# EAGLE schematic RESC_V2 v61 (EAGLE 9.7.0)

## Sheet 1 of 7
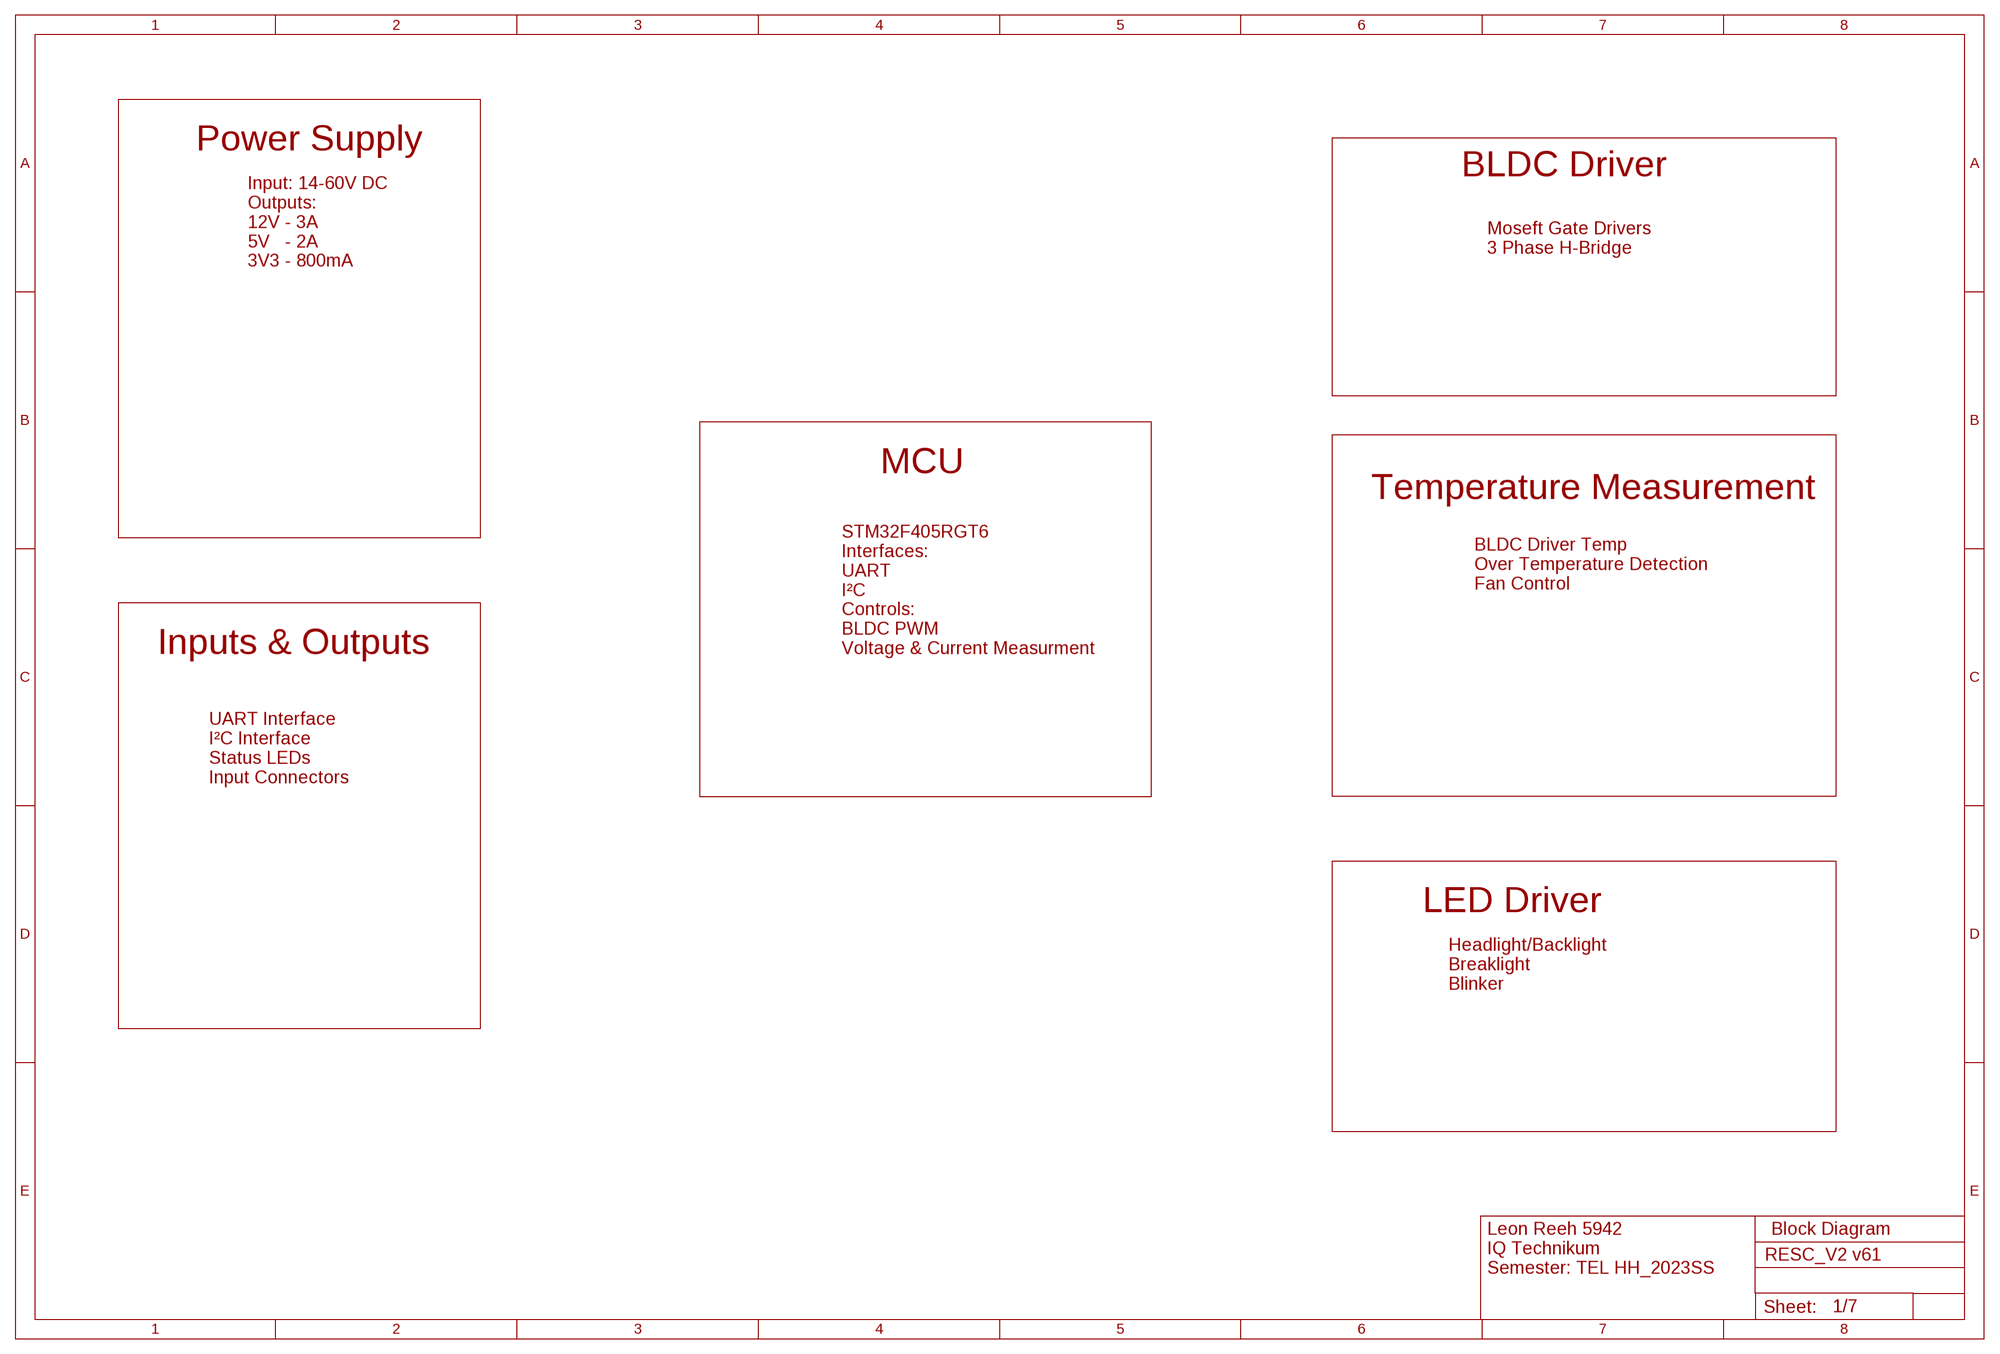
[diagram p0: schematic, sheet 1]

### Notes on the sheet
- Power Supply
- BLDC Driver
- Moseft Gate Drivers
  3 Phase H-Bridge
- Input: 14-60V DC
  Outputs:
  12V - 3A
  5V   - 2A
  3V3 - 800mA
- MCU
- Temperature Measurement
- BLDC Driver Temp
  Over Temperature Detection
  Fan Control
- Inputs & Outputs
- STM32F405RGT6
  Interfaces:
  UART
  I²C
  Controls:
  BLDC PWM
  Voltage & Current Measurment
- UART Interface
  I²C Interface
  Status LEDs
  Input Connectors
- LED Driver
- Headlight/Backlight
  Breaklight
  Blinker
- Block Diagram
- Leon Reeh 5942
  IQ Technikum
  Semester: TEL HH_2023SS

## Sheet 2 of 7
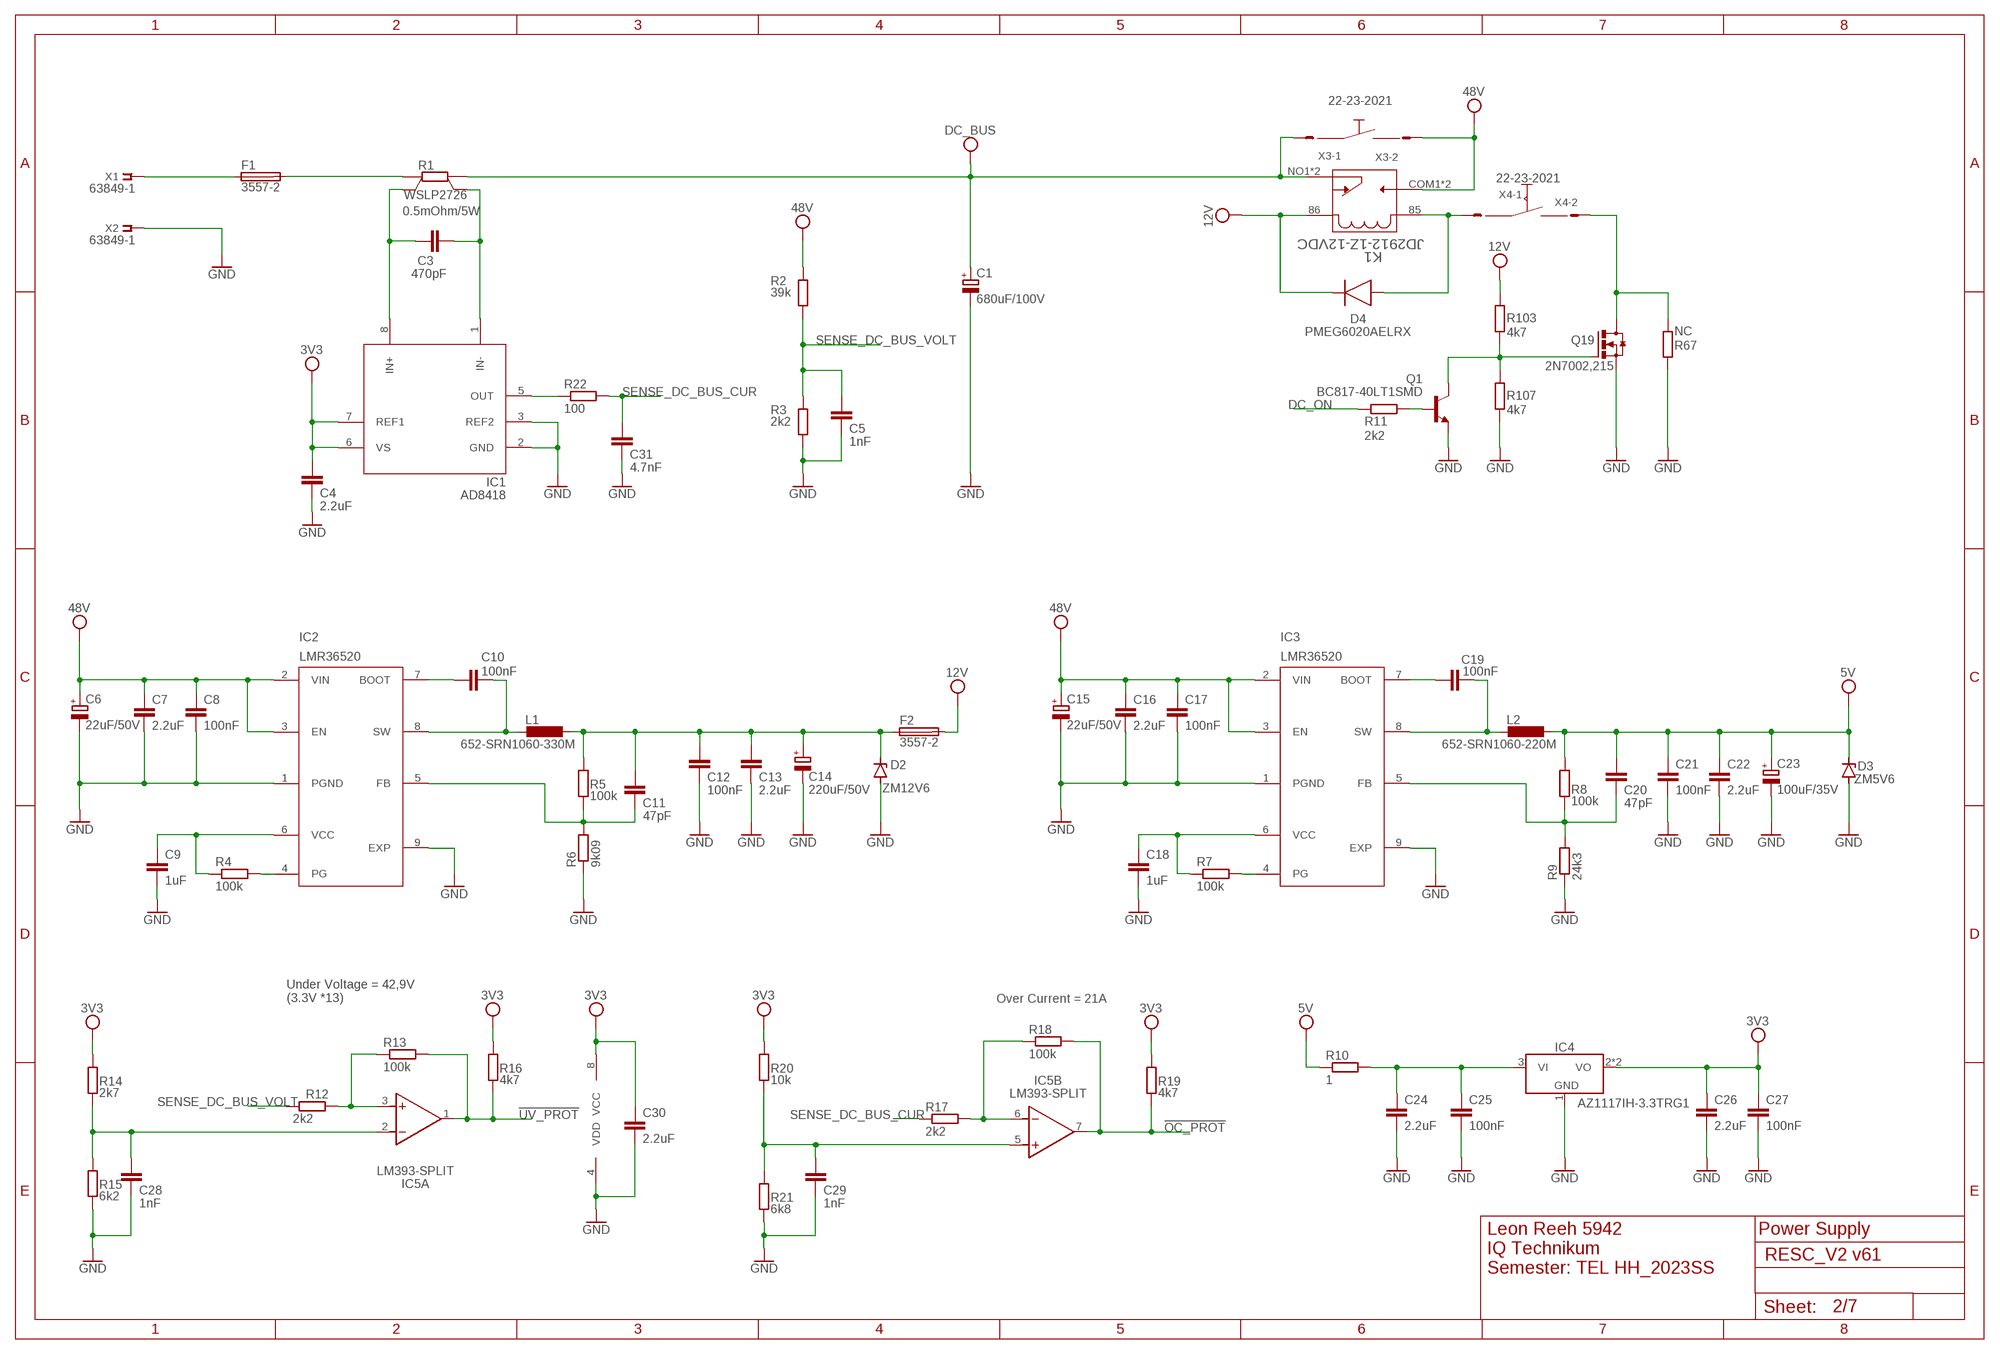
[diagram p1: schematic, sheet 2]

### Parts
C1  680uF/100V  CPOL-EUE10-35  [EB35D]
C3  470pF  C-EUC0603  [C0603]
C4  2.2uF  C-EUC0603  [C0603]
C5  1nF  C-EUC0603  [C0603]
C6  22uF/50V  CPOL-EUE2-5  [E2-5]
C7  2.2uF  C-EUC0805  [C0805]
C8  100nF  C-EUC0603  [C0603]
C9  1uF  C-EUC0805  [C0805]
C10  100nF  C-EUC0603  [C0603]
C11  47pF  C-EUC0603  [C0603]
C12  100nF  C-EUC0805  [C0805]
C13  2.2uF  C-EUC0805  [C0805]
C14  220uF/50V  CPOL-EU  [E5-13]
C15  22uF/50V  CPOL-EUE2-5  [E2-5]
C16  2.2uF  C-EUC0805  [C0805]
C17  100nF  C-EUC0603  [C0603]
C18  1uF  C-EUC0805  [C0805]
C19  100nF  C-EUC0603  [C0603]
C20  47pF  C-EUC0603  [C0603]
C21  100nF  C-EUC0805  [C0805]
C22  2.2uF  C-EUC0805  [C0805]
C23  100uF/35V  CPOL-EUE3.5-8  [E3,5-8]
C24  2.2uF  C-EUC0805  [C0805]
C25  100nF  C-EUC0805  [C0805]
C26  2.2uF  C-EUC0805  [C0805]
C27  100nF  C-EUC0805  [C0805]
C28  1nF  C-EUC0603  [C0603]
C29  1nF  C-EUC0603  [C0603]
C30  2.2uF  C-EUC0603  [C0603]
C31  4.7nF  C-EUC0603  [C0603]
D2  ZM12V6  ZENER_TZM5231BDO-213AA(SOD-80)  [DIOMELF3516]
D3  ZM5V6  ZENER_TZM5231BDO-213AA(SOD-80)  [DIOMELF3516]
D4  PMEG6020AELRX  DIODE_MMSD4148T1G_SOD123G  [SOD3715X135]
F1  3557-2  [M60]
F2  3557-2  [M60]
IC1  AD8418  [SOP65P490X110-8N]
IC2  LMR36520  [HSOIC]
IC3  LMR36520  [HSOIC]
IC4  AZ1117IH-3.3TRG1  [SOT230P700X170-4]
IC5  LM393-SPLIT  [SOIC127P600X175-8]
K1  JD2912-1Z-12VDC  [JD2912-1Z-12VDC]
L1  652-SRN1060-330M  7847870SRN1016  [SRN1016]
L2  652-SRN1060-220M  7847870SRN1016  [SRN1016]
Q1  BC817-40LT1SMD  [SOT23-BEC]
Q19  2N7002,215  [SOT23-3]
R1  WSLP2726  [WSLP2726]
R2  39k  R-EU_R0603  [R0603]
R3  2k2  R-EU_R0603  [R0603]
R4  100k  R-EU_R0603  [R0603]
R5  100k  R-EU_R0603  [R0603]
R6  9k09  R-EU_R0603  [R0603]
R7  100k  R-EU_R0603  [R0603]
R8  100k  R-EU_R0603  [R0603]
R9  24k3  R-EU_R0603  [R0603]
R10  1  R-EU_R1206  [R1206]
R11  2k2  R-EU_R0603  [R0603]
R12  2k2  R-EU_R0603  [R0603]
R13  100k  R-EU_R0603  [R0603]
R14  2k7  R-EU_R0603  [R0603]
R15  6k2  R-EU_R0603  [R0603]
R16  4k7  R-EU_R0603  [R0603]
R17  2k2  R-EU_R0603  [R0603]
R18  100k  R-EU_R0603  [R0603]
R19  4k7  R-EU_R0603  [R0603]
R20  10k  R-EU_R0603  [R0603]
R21  6k8  R-EU_R0603  [R0603]
R22  100  R-EU_R0603  [R0603]
R67  NC  R-EU_R1206  [R1206]
R103  4k7  R-EU_R0603  [R0603]
R107  4k7  R-EU_R0603  [R0603]
X1  63849-1  [63849-1]
X2  63849-1  [63849-1]
X3  22-23-2021  [22-23-2021]
X4  22-23-2021  [22-23-2021]

### Nets
3V3: C4.1 C26.1 C27.1 C30.1 IC1.6(VS) IC1.7(REF1) IC4.2(VO) IC4.4(VO) IC5.8(SUPPLY:VCC) R14.2 R16.2 R19.2 R20.2 ; also sheet 3,4,5,6,7
5V: C20.1 C21.1 C22.1 C23.+ D3.1(C) L2.1 R8.2 R10.1 ; also sheet 3,7
12V: D4.1(C) F2.P$3 F2.P$4 K1.86(A2) R103.2 ; also sheet 4,5,6,7
48V: C6.+ C7.1 C8.1 C15.+ C16.1 C17.1 IC2.2(VIN) IC2.3(EN) IC3.2(VIN) IC3.3(EN) K1.COM1 K1.COM2 R2.1 X3.2
!OC_PROT: IC5.7(B:OUT) R18.2 R19.1 ; also sheet 3
!UV_PROT: IC5.1(A:OUT) R13.2 R16.1 ; also sheet 3
DC_BUS: C1.+ K1.NO1 K1.NO2 R1.P$1(A) X3.1 ; also sheet 4
DC_ON: R11.1 ; also sheet 3
GND: C1.- C4.2 C5.2 C6.- C7.2 C8.2 C9.2 C12.2 C13.2 C14.- C15.- C16.2 C17.2 C18.2 C21.2 C22.2 C23.- C24.2 C25.2 C26.2 C27.2 C28.2 C29.2 C30.2 C31.2 D2.2(A) D3.2(A) IC1.2(GND) IC1.3(REF2) IC2.1(PGND) IC2.9(EXP) IC3.1(PGND) IC3.9(EXP) IC4.1(GND) IC5.4(SUPPLY:VDD) Q1.E Q19.2(S) R3.2 R6.1 R9.1 R15.1 R21.1 R67.2 R107.1 X2.1(S) X2.2(S) ; also sheet 3,4,5,6,7
N$1: F1.P$1 F1.P$2 X1.1(S) X1.2(S)
N$2: F1.P$3 F1.P$4 R1.P$2(B)
N$3: C3.1 IC1.8(IN+) R1.P$4(SB)
N$4: C3.2 IC1.1(IN-) R1.P$3(SA)
N$5: C18.1 IC3.6(VCC) R7.1
N$6: C10.2 IC2.8(SW) L1.2
N$7: Q19.3(D) R67.1 X4.2
N$8: C9.1 IC2.6(VCC) R4.1
N$9: IC2.4(PG) R4.2
N$10: C10.1 IC2.7(BOOT)
N$11: C11.2 IC2.5(FB) R5.1 R6.2
N$12: C11.1 C12.1 C13.1 C14.+ D2.1(C) F2.P$1 F2.P$2 L1.1 R5.2
N$13: IC3.4(PG) R7.2
N$14: C19.2 IC3.8(SW) L2.2
N$15: C19.1 IC3.7(BOOT)
N$16: C20.2 IC3.5(FB) R8.1 R9.2
N$17: C24.1 C25.1 IC4.3(VI) R10.2
N$18: D4.2(A) K1.85(A1) X4.1
N$19: Q1.C Q19.1(G) R103.1 R107.2
N$20: Q1.B R11.2
N$22: IC5.3(A:+IN) R12.2 R13.1
N$23: IC5.6(B:-IN) R17.2 R18.1
N$24: C28.1 IC5.2(A:-IN) R14.1 R15.2
N$25: IC1.5(OUT) R22.1
N$26: C29.1 IC5.5(B:+IN) R20.1 R21.2
SENSE_DC_BUS_CUR: C31.1 R17.1 R22.2 ; also sheet 3
SENSE_DC_BUS_VOLT: C5.1 R2.2 R3.1 R12.1 ; also sheet 3

### Notes on the sheet
- 0.5mOhm/5W
- Over Current = 21A
- Under Voltage = 42,9V
  (3.3V *13)
- Power Supply
- Leon Reeh 5942
  IQ Technikum
  Semester: TEL HH_2023SS

## Sheet 3 of 7
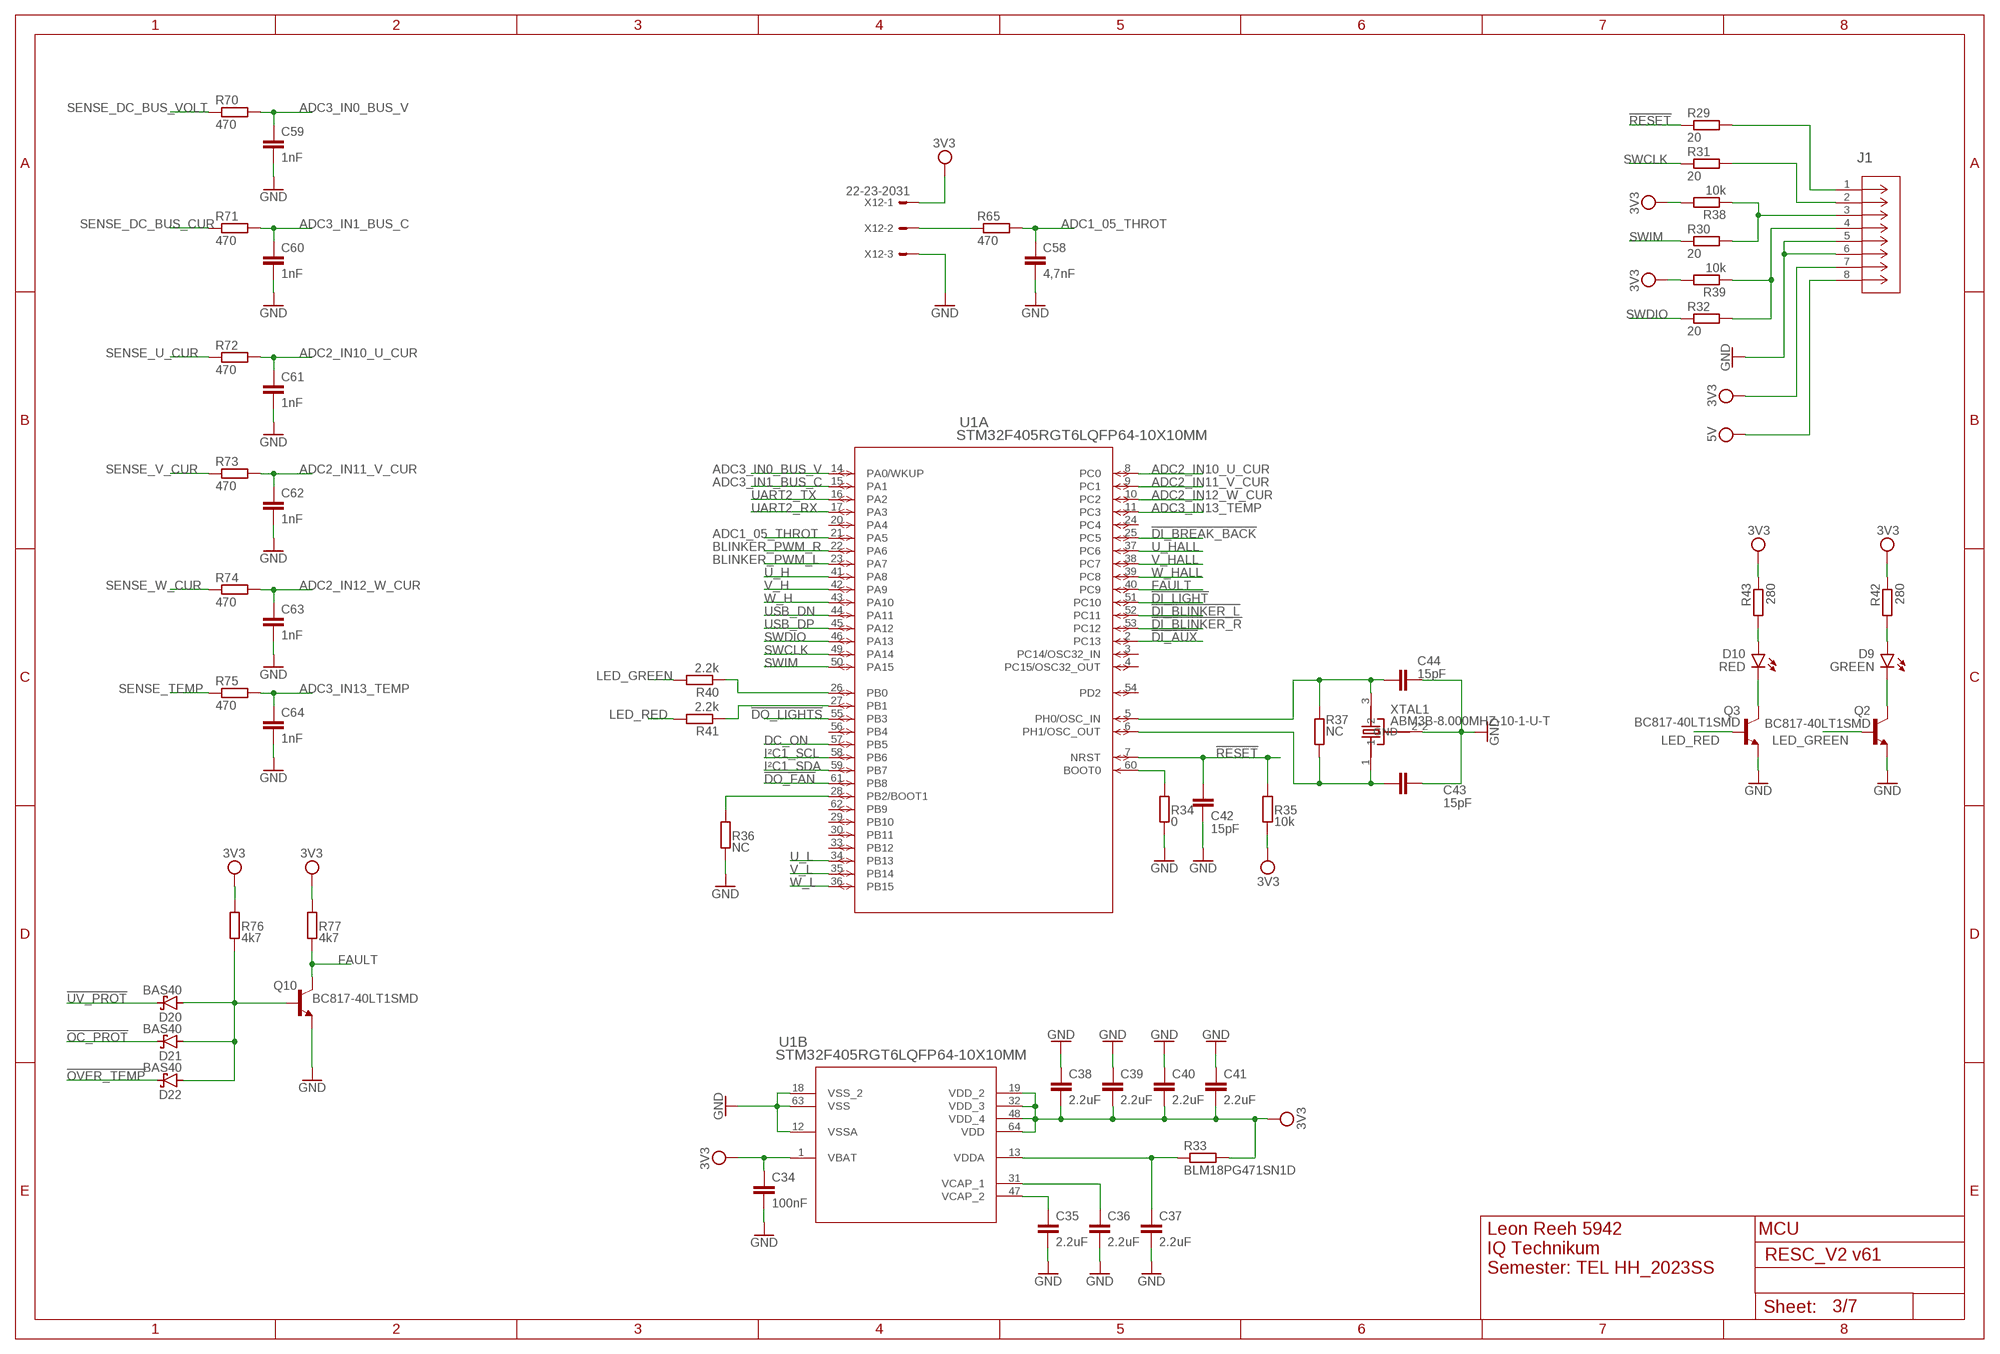
[diagram p2: schematic, sheet 3]

### Parts
C34  100nF  C-EUC0603  [C0603]
C35  2.2uF  C-EUC0805  [C0805]
C36  2.2uF  C-EUC0805  [C0805]
C37  2.2uF  C-EUC0805  [C0805]
C38  2.2uF  C-EUC0805  [C0805]
C39  2.2uF  C-EUC0805  [C0805]
C40  2.2uF  C-EUC0805  [C0805]
C41  2.2uF  C-EUC0805  [C0805]
C42  15pF  C-EUC0603  [C0603]
C43  15pF  C-EUC0603  [C0603]
C44  15pF  C-EUC0603  [C0603]
C58  4,7nF  C-EUC0603  [C0603]
C59  1nF  C-EUC0603  [C0603]
C60  1nF  C-EUC0603  [C0603]
C61  1nF  C-EUC0603  [C0603]
C62  1nF  C-EUC0603  [C0603]
C63  1nF  C-EUC0603  [C0603]
C64  1nF  C-EUC0603  [C0603]
D9  GREEN  CHIP-FLAT-B_1206  [LEDC3216X75N_FLAT-B]
D10  RED  CHIP-FLAT-B_1206  [LEDC3216X75N_FLAT-B]
D20  BAS40  [SOT23]
D21  BAS40  [SOT23]
D22  BAS40  [SOT23]
J1  BM08B-SRSS-TB(LF)(SN)CONN_BM08B-SRSS-TB(LF)(SN)_JST  [CONN_BM08B-SRSS-TB(LF)(SN)_JST]
Q2  BC817-40LT1SMD  [SOT23-BEC]
Q3  BC817-40LT1SMD  [SOT23-BEC]
Q10  BC817-40LT1SMD  [SOT23-BEC]
R29  20  R-EU_R0603  [R0603]
R30  20  R-EU_R0603  [R0603]
R31  20  R-EU_R0603  [R0603]
R32  20  R-EU_R0603  [R0603]
R33  BLM18PG471SN1D  R-EU_R0603  [R0603]
R34  0  R-EU_R0603  [R0603]
R35  10k  R-EU_R0603  [R0603]
R36  NC  R-EU_R0603  [R0603]
R37  NC  R-EU_R0603  [R0603]
R38  10k  R-EU_R0603  [R0603]
R39  10k  R-EU_R0603  [R0603]
R40  2.2k  R-EU_R0603  [R0603]
R41  2.2k  R-EU_R0603  [R0603]
R42  280  R-EU_R1206  [R1206]
R43  280  R-EU_R1206  [R1206]
R65  470  R-EU_R0603  [R0603]
R70  470  R-EU_R0603  [R0603]
R71  470  R-EU_R0603  [R0603]
R72  470  R-EU_R0603  [R0603]
R73  470  R-EU_R0603  [R0603]
R74  470  R-EU_R0603  [R0603]
R75  470  R-EU_R0603  [R0603]
R76  4k7  R-EU_R0603  [R0603]
R77  4k7  R-EU_R0603  [R0603]
U1  STM32F405RGT6LQFP64-10X10MM  [LQFP64-10X10MM]
X12  22-23-2031  [22-23-2031]
XTAL1  ABM3B-8.000MHZ-10-1-U-T  7BFREQUENCY_8MHZ  [OSCSC500X320X105-4N]

### Nets
3V3: C34.1 C38.2 C39.2 C40.2 C41.2 J1.7 R33.2 R35.1 R38.2 R39.2 R42.1 R43.1 R76.2 R77.2 U1.1(B:VBAT) U1.19(B:VDD_2) U1.32(B:VDD_3) U1.48(B:VDD_4) U1.64(B:VDD) X12.1 ; also sheet 2,4,5,6,7
5V: J1.8 ; also sheet 2,7
!DI_AUX: U1.2(A:PC13) ; also sheet 7
!DI_BLINKER_L: U1.52(A:PC11) ; also sheet 7
!DI_BLINKER_R: U1.53(A:PC12) ; also sheet 7
!DI_BREAK_BACK: U1.25(A:PC5) ; also sheet 5,7
!DI_LIGHT: U1.51(A:PC10) ; also sheet 7
!DO_FAN: U1.61(A:PB8) ; also sheet 6
!DO_LIGHTS: U1.55(A:PB3) ; also sheet 5
!OC_PROT: D21.3(C) ; also sheet 2
!OVER_TEMP: D22.3(C) ; also sheet 6
!RESET: C42.1 R29.1 R35.2 U1.7(A:NRST)
!UV_PROT: D20.3(C) ; also sheet 2
ADC1_05_THROT: C58.1 R65.2 U1.21(A:PA5)
ADC2_IN10_U_CUR: C61.1 R72.2 U1.8(A:PC0)
ADC2_IN11_V_CUR: C62.1 R73.2 U1.9(A:PC1)
ADC2_IN12_W_CUR: C63.1 R74.2 U1.10(A:PC2)
ADC3_IN0_BUS_V: C59.1 R70.2 U1.14(A:PA0/WKUP)
ADC3_IN1_BUS_C: C60.1 R71.2 U1.15(A:PA1)
ADC3_IN13_TEMP: C64.1 R75.2 U1.11(A:PC3)
BLINKER_PWM_L: U1.23(A:PA7) ; also sheet 5
BLINKER_PWM_R: U1.22(A:PA6) ; also sheet 5
DC_ON: U1.57(A:PB5) ; also sheet 2
FAULT: Q10.C R77.1 U1.40(A:PC9)
GND: C34.2 C35.2 C36.2 C37.2 C38.1 C39.1 C40.1 C41.1 C42.2 C43.2 C44.2 C58.2 C59.2 C60.2 C61.2 C62.2 C63.2 C64.2 J1.5 J1.6 Q2.E Q3.E Q10.E R34.1 R36.1 U1.12(B:VSSA) U1.18(B:VSS_2) U1.63(B:VSS) X12.3 XTAL1.2(GND) XTAL1.4(GND) ; also sheet 2,4,5,6,7
I²C1_SCL: U1.58(A:PB6) ; also sheet 7
I²C1_SDA: U1.59(A:PB7) ; also sheet 7
LED_GREEN: Q2.B R40.2
LED_RED: Q3.B R41.2
N$29: J1.1 R29.2
N$30: J1.2 R31.2
N$36: C35.1 U1.47(B:VCAP_2)
N$37: C36.1 U1.31(B:VCAP_1)
N$38: C37.1 R33.1 U1.13(B:VDDA)
N$39: R34.2 U1.60(A:BOOT0)
N$40: R36.2 U1.28(A:PB2/BOOT1)
N$41: C43.1 R37.1 U1.6(A:PH1/OSC_OUT) XTAL1.1
N$42: C44.1 R37.2 U1.5(A:PH0/OSC_IN) XTAL1.3
N$43: R41.1 U1.27(A:PB1)
N$44: R40.1 U1.26(A:PB0)
N$45: D9.A R42.2
N$46: D9.C Q2.C
N$47: D10.C Q3.C
N$48: D10.A R43.2
N$63: R65.1 X12.2
N$72: D20.1(A) D21.1(A) D22.1(A) Q10.B R76.1
SENSE_DC_BUS_CUR: R71.1 ; also sheet 2
SENSE_DC_BUS_VOLT: R70.1 ; also sheet 2
SENSE_TEMP: R75.1 ; also sheet 6
SENSE_U_CUR: R72.1 ; also sheet 4
SENSE_V_CUR: R73.1 ; also sheet 4
SENSE_W_CUR: R74.1 ; also sheet 4
SWCLK: R31.1 U1.49(A:PA14)
SWCLK1: J1.4 R32.2 R39.1
SWDIO: R32.1 U1.46(A:PA13)
SWDIO1: J1.3 R30.2 R38.1
SWIM: R30.1 U1.50(A:PA15)
U_H: U1.41(A:PA8) ; also sheet 4
U_HALL: U1.37(A:PC6) ; also sheet 7
U_L: U1.34(A:PB13) ; also sheet 4
UART2_RX: U1.17(A:PA3) ; also sheet 7
UART2_TX: U1.16(A:PA2) ; also sheet 7
USB_DN: U1.44(A:PA11)
USB_DP: U1.45(A:PA12)
V_H: U1.42(A:PA9) ; also sheet 4
V_HALL: U1.38(A:PC7) ; also sheet 7
V_L: U1.35(A:PB14) ; also sheet 4
W_H: U1.43(A:PA10) ; also sheet 4
W_HALL: U1.39(A:PC8) ; also sheet 7
W_L: U1.36(A:PB15) ; also sheet 4
Unconnected: U1.3(A:PC14/OSC32_IN) U1.4(A:PC15/OSC32_OUT) U1.20(A:PA4) U1.24(A:PC4) U1.29(A:PB10) U1.30(A:PB11) U1.33(A:PB12) U1.54(A:PD2) U1.56(A:PB4) U1.62(A:PB9)

### Notes on the sheet
- MCU
- Leon Reeh 5942
  IQ Technikum
  Semester: TEL HH_2023SS

## Sheet 4 of 7
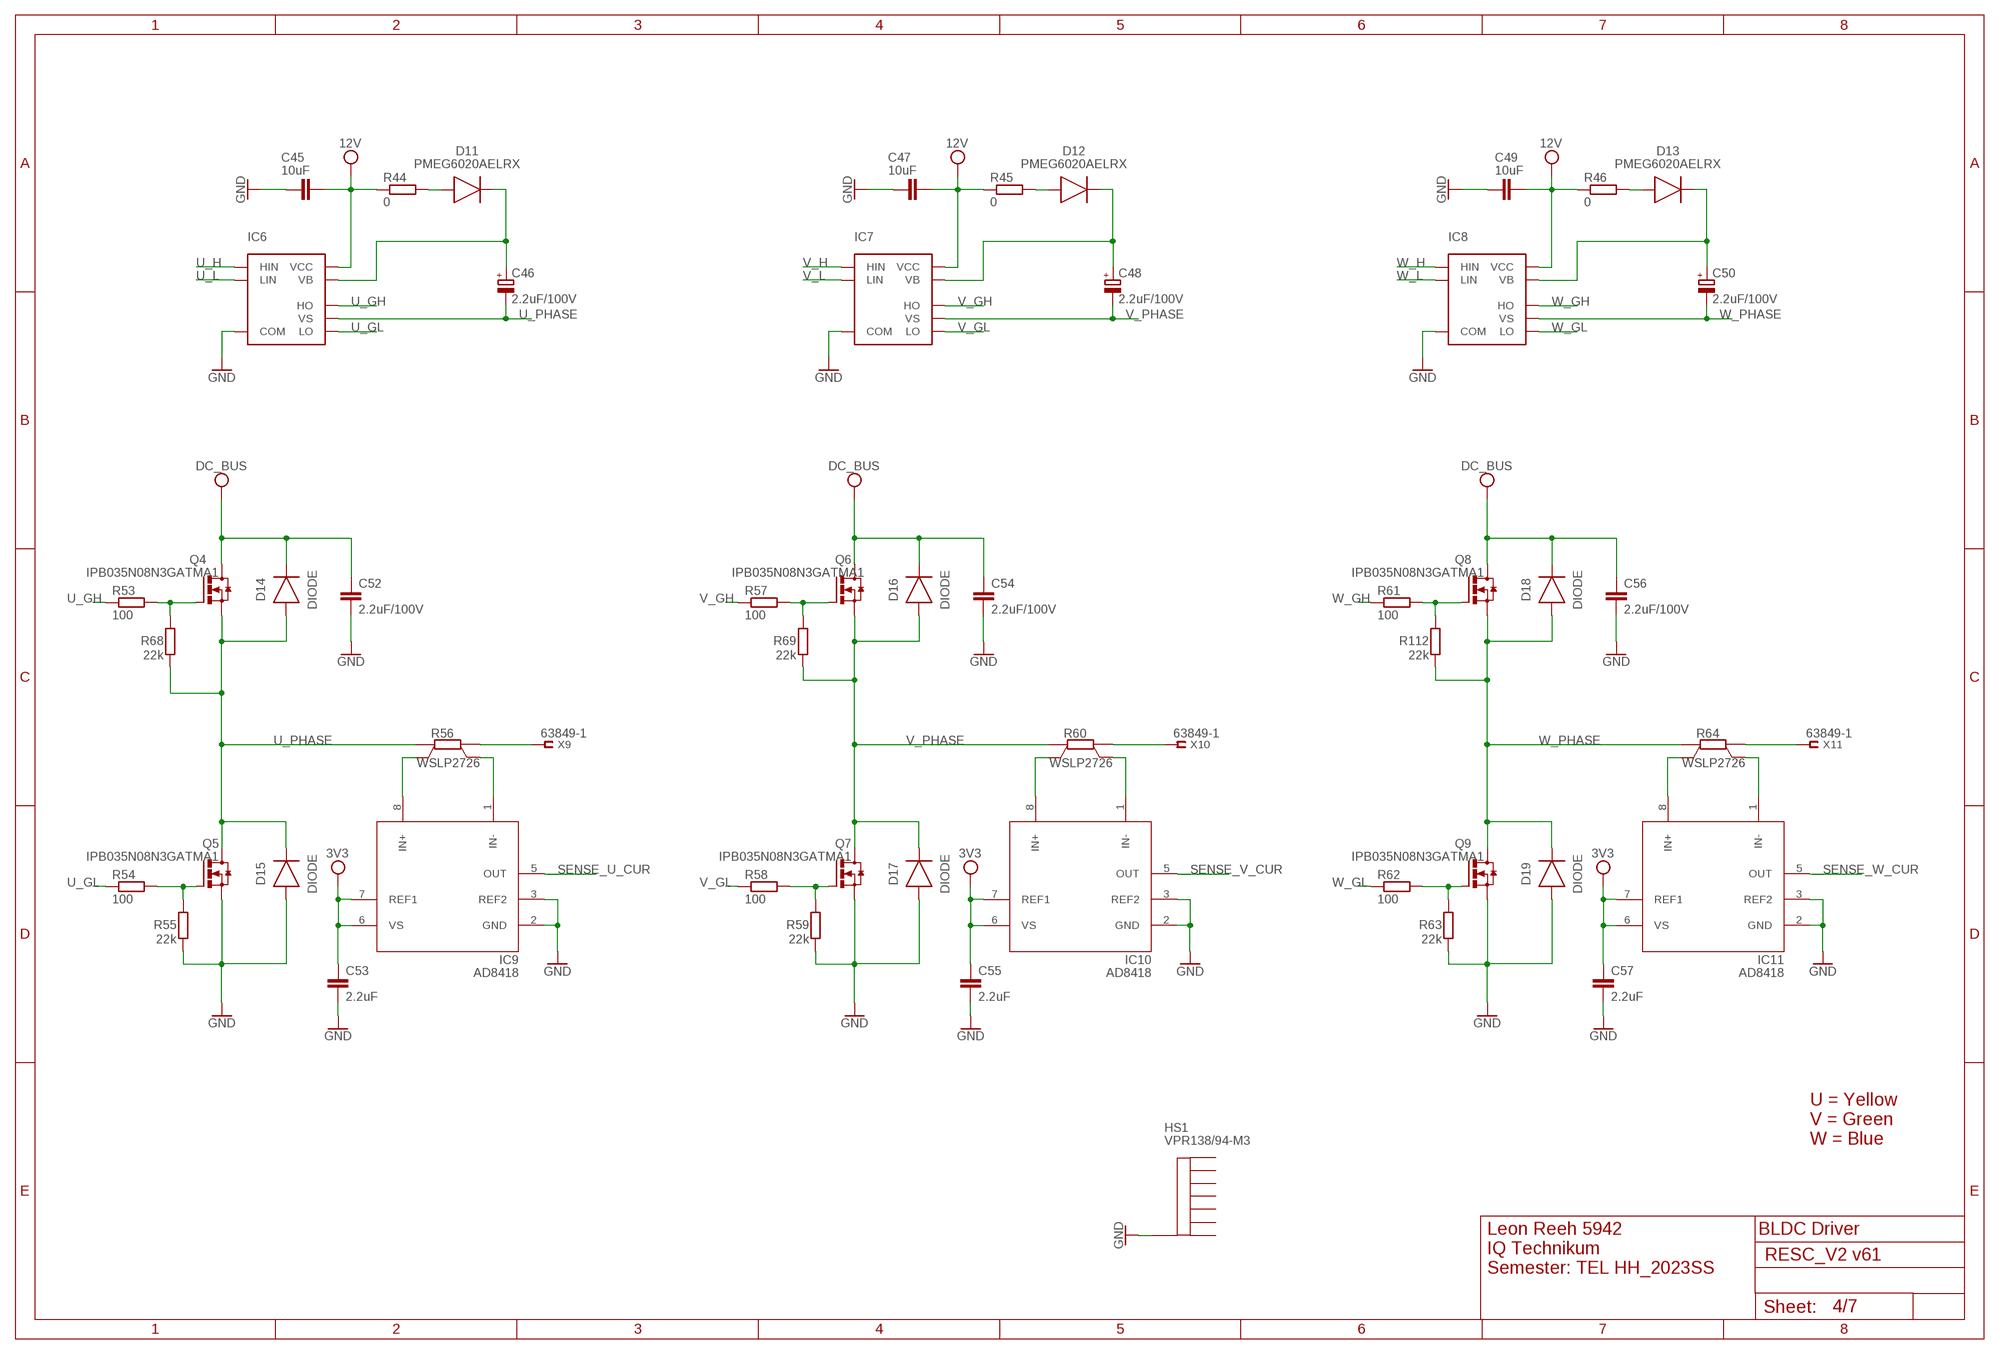
[diagram p3: schematic, sheet 4]

### Parts
C45  10uF  C-EUC1206  [C1206]
C46  2.2uF/100V  CPOL-EUE2-5  [E2-5]
C47  10uF  C-EUC1206  [C1206]
C48  2.2uF/100V  CPOL-EUE2-5  [E2-5]
C49  10uF  C-EUC1206  [C1206]
C50  2.2uF/100V  CPOL-EUE2-5  [E2-5]
C52  2.2uF/100V  C-EUC1210  [C1210]
C53  2.2uF  C-EUC0603  [C0603]
C54  2.2uF/100V  C-EUC1210  [C1210]
C55  2.2uF  C-EUC0603  [C0603]
C56  2.2uF/100V  C-EUC1210  [C1210]
C57  2.2uF  C-EUC0603  [C0603]
D11  PMEG6020AELRX  DIODE_MMSD4148T1G_SOD123G  [SOD3715X135]
D12  PMEG6020AELRX  DIODE_MMSD4148T1G_SOD123G  [SOD3715X135]
D13  PMEG6020AELRX  DIODE_MMSD4148T1G_SOD123G  [SOD3715X135]
D14  DIODE  DIODEDO-214AA(SMB)  [DIOM5336X265N]
D15  DIODE  DIODEDO-214AA(SMB)  [DIOM5336X265N]
D16  DIODE  DIODEDO-214AA(SMB)  [DIOM5336X265N]
D17  DIODE  DIODEDO-214AA(SMB)  [DIOM5336X265N]
D18  DIODE  DIODEDO-214AA(SMB)  [DIOM5336X265N]
D19  DIODE  DIODEDO-214AA(SMB)  [DIOM5336X265N]
HS1  VPR138/94-M3  [VPR138/94-M3]
IC6  IR2101S  [SO08]
IC7  IR2101S  [SO08]
IC8  IR2101S  [SO08]
IC9  AD8418  [SOP65P490X110-8N]
IC10  AD8418  [SOP65P490X110-8N]
IC11  AD8418  [SOP65P490X110-8N]
Q4  IPB035N08N3GATMA1  [PG-TO263-3]
Q5  IPB035N08N3GATMA1  [PG-TO263-3]
Q6  IPB035N08N3GATMA1  [PG-TO263-3]
Q7  IPB035N08N3GATMA1  [PG-TO263-3]
Q8  IPB035N08N3GATMA1  [PG-TO263-3]
Q9  IPB035N08N3GATMA1  [PG-TO263-3]
R44  0  R-EU_R1206  [R1206]
R45  0  R-EU_R1206  [R1206]
R46  0  R-EU_R1206  [R1206]
R53  100  R-EU_R1206  [R1206]
R54  100  R-EU_R1206  [R1206]
R55  22k  R-EU_R1206  [R1206]
R56  WSLP2726  [WSLP2726]
R57  100  R-EU_R1206  [R1206]
R58  100  R-EU_R1206  [R1206]
R59  22k  R-EU_R1206  [R1206]
R60  WSLP2726  [WSLP2726]
R61  100  R-EU_R1206  [R1206]
R62  100  R-EU_R1206  [R1206]
R63  22k  R-EU_R1206  [R1206]
R64  WSLP2726  [WSLP2726]
R68  22k  R-EU_R1206  [R1206]
R69  22k  R-EU_R1206  [R1206]
R112  22k  R-EU_R1206  [R1206]
X9  63849-1  [63849-1]
X10  63849-1  [63849-1]
X11  63849-1  [63849-1]

### Nets
3V3: C53.1 C55.1 C57.1 IC9.6(VS) IC9.7(REF1) IC10.6(VS) IC10.7(REF1) IC11.6(VS) IC11.7(REF1) ; also sheet 2,3,5,6,7
12V: C45.2 C47.2 C49.2 IC6.1(VCC) IC7.1(VCC) IC8.1(VCC) R44.1 R45.1 R46.1 ; also sheet 2,5,6,7
DC_BUS: C52.1 C54.1 C56.1 D14.1(C) D16.1(C) D18.1(C) Q4.2(D) Q6.2(D) Q8.2(D) ; also sheet 2
GND: C45.1 C47.1 C49.1 C52.2 C53.2 C54.2 C55.2 C56.2 C57.2 D15.2(A) D17.2(A) D19.2(A) HS1.P$3 IC6.4(COM) IC7.4(COM) IC8.4(COM) IC9.2(GND) IC9.3(REF2) IC10.2(GND) IC10.3(REF2) IC11.2(GND) IC11.3(REF2) Q5.3(S) Q7.3(S) Q9.3(S) R55.1 R59.1 R63.1 ; also sheet 2,3,5,6,7
N$50: D11.2(A) R44.2
N$52: C46.+ D11.1(C) IC6.8(VB)
N$55: Q4.1(G) R53.2 R68.2
N$56: R56.P$1(A) X9.1(S) X9.2(S)
N$58: D12.2(A) R45.2
N$59: Q5.1(G) R54.2 R55.2
N$60: C48.+ D12.1(C) IC7.8(VB)
N$61: IC9.8(IN+) R56.P$4(SB)
N$62: IC9.1(IN-) R56.P$3(SA)
N$64: Q6.1(G) R57.2 R69.2
N$66: D13.2(A) R46.2
N$67: Q7.1(G) R58.2 R59.2
N$68: C50.+ D13.1(C) IC8.8(VB)
N$69: R60.P$1(A) X10.1(S) X10.2(S)
N$70: IC10.8(IN+) R60.P$4(SB)
N$71: IC10.1(IN-) R60.P$3(SA)
N$73: Q8.1(G) R61.2 R112.2
N$74: Q9.1(G) R62.2 R63.2
N$75: R64.P$1(A) X11.1(S) X11.2(S)
N$76: IC11.8(IN+) R64.P$4(SB)
N$77: IC11.1(IN-) R64.P$3(SA)
SENSE_U_CUR: IC9.5(OUT) ; also sheet 3
SENSE_V_CUR: IC10.5(OUT) ; also sheet 3
SENSE_W_CUR: IC11.5(OUT) ; also sheet 3
U_GH: IC6.7(HO) R53.1
U_GL: IC6.5(LO) R54.1
U_H: IC6.2(HIN) ; also sheet 3
U_L: IC6.3(LIN) ; also sheet 3
U_PHASE: C46.- D14.2(A) D15.1(C) IC6.6(VS) Q4.3(S) Q5.2(D) R56.P$2(B) R68.1
V_GH: IC7.7(HO) R57.1
V_GL: IC7.5(LO) R58.1
V_H: IC7.2(HIN) ; also sheet 3
V_L: IC7.3(LIN) ; also sheet 3
V_PHASE: C48.- D16.2(A) D17.1(C) IC7.6(VS) Q6.3(S) Q7.2(D) R60.P$2(B) R69.1
W_GH: IC8.7(HO) R61.1
W_GL: IC8.5(LO) R62.1
W_H: IC8.2(HIN) ; also sheet 3
W_L: IC8.3(LIN) ; also sheet 3
W_PHASE: C50.- D18.2(A) D19.1(C) IC8.6(VS) Q8.3(S) Q9.2(D) R64.P$2(B) R112.1

### Notes on the sheet
- U = Yellow
  V = Green
  W = Blue
- BLDC Driver
- Leon Reeh 5942
  IQ Technikum
  Semester: TEL HH_2023SS

## Sheet 5 of 7
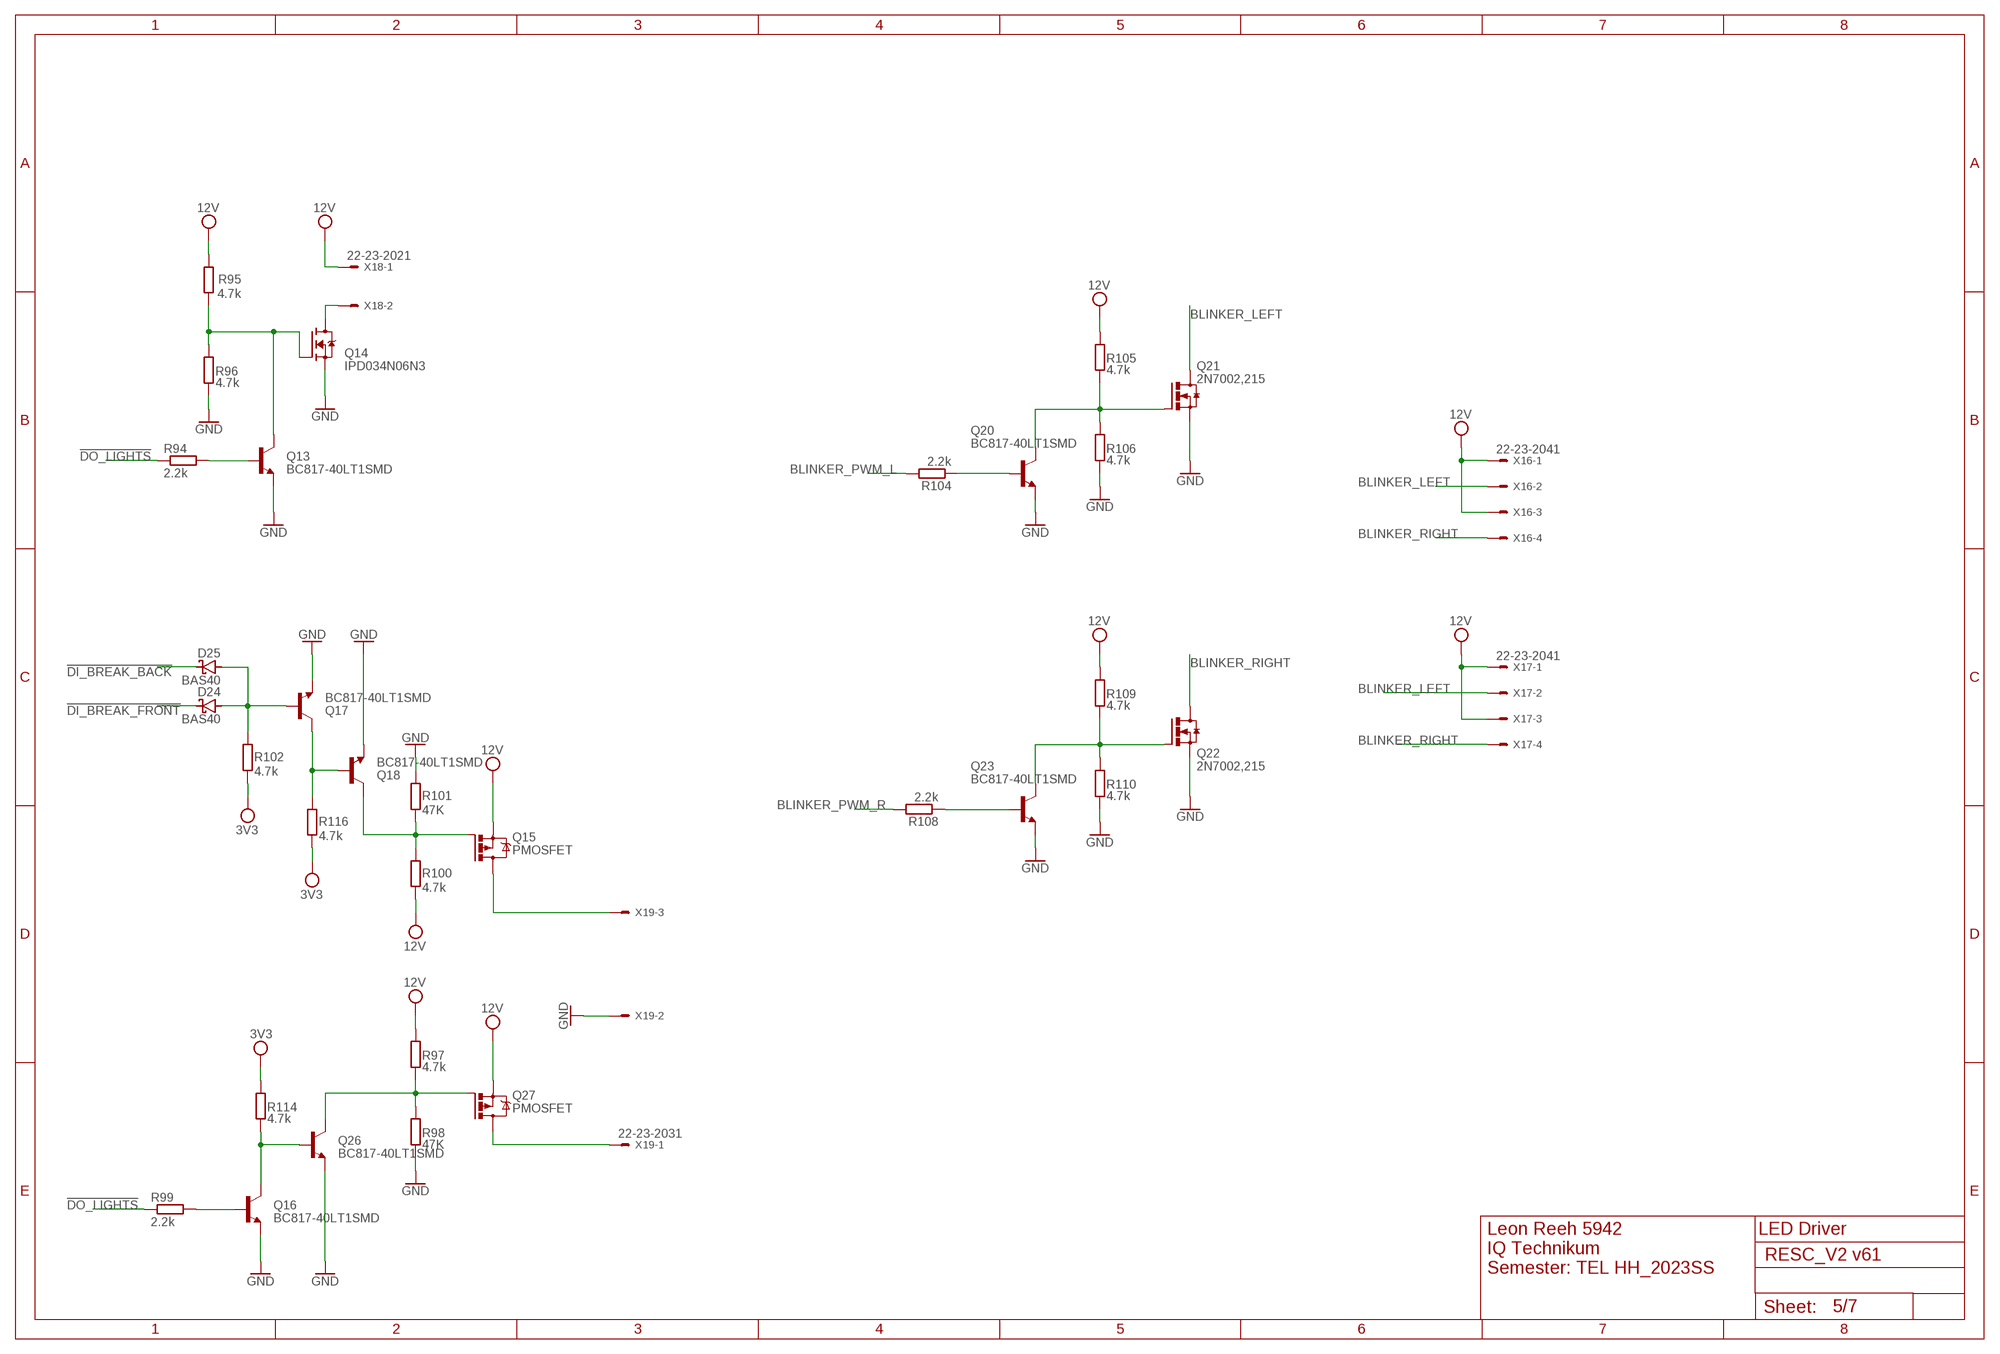
[diagram p4: schematic, sheet 5]

### Parts
D24  BAS40  [SOT23]
D25  BAS40  [SOT23]
Q13  BC817-40LT1SMD  [SOT23-BEC]
Q14  IPD034N06N3  [TO252]
Q15  PMOSFET  PMOSFET_SOT23-GSD  [SOT23]
Q16  BC817-40LT1SMD  [SOT23-BEC]
Q17  BC817-40LT1SMD  [SOT23-BEC]
Q18  BC817-40LT1SMD  [SOT23-BEC]
Q20  BC817-40LT1SMD  [SOT23-BEC]
Q21  2N7002,215  [SOT23-3]
Q22  2N7002,215  [SOT23-3]
Q23  BC817-40LT1SMD  [SOT23-BEC]
Q26  BC817-40LT1SMD  [SOT23-BEC]
Q27  PMOSFET  PMOSFET_SOT23-GSD  [SOT23]
R94  2.2k  R-EU_R0603  [R0603]
R95  4.7k  R-EU_R0603  [R0603]
R96  4.7k  R-EU_R0603  [R0603]
R97  4.7k  R-EU_R0603  [R0603]
R98  47K  R-EU_R0603  [R0603]
R99  2.2k  R-EU_R0603  [R0603]
R100  4.7k  R-EU_R0603  [R0603]
R101  47K  R-EU_R0603  [R0603]
R102  4.7k  R-EU_R0603  [R0603]
R104  2.2k  R-EU_R0603  [R0603]
R105  4.7k  R-EU_R0603  [R0603]
R106  4.7k  R-EU_R0603  [R0603]
R108  2.2k  R-EU_R0603  [R0603]
R109  4.7k  R-EU_R0603  [R0603]
R110  4.7k  R-EU_R0603  [R0603]
R114  4.7k  R-EU_R0603  [R0603]
R116  4.7k  R-EU_R0603  [R0603]
X16  22-23-2041  [22-23-2041]
X17  22-23-2041  [22-23-2041]
X18  22-23-2021  [22-23-2021]
X19  22-23-2031  [22-23-2031]

### Nets
3V3: R102.2 R114.2 R116.2 ; also sheet 2,3,4,6,7
12V: Q15.2(S) Q27.2(S) R95.2 R97.2 R100.2 R105.2 R109.2 X16.1 X16.3 X17.1 X17.3 X18.1 ; also sheet 2,4,6,7
!DI_BREAK_BACK: D25.3(C) ; also sheet 3,7
!DI_BREAK_FRONT: D24.3(C) ; also sheet 7
!DO_LIGHTS: R94.1 R99.1 ; also sheet 3
BLINKER_LEFT: Q21.3(D) X16.2 X17.2
BLINKER_PWM_L: R104.2 ; also sheet 3
BLINKER_PWM_R: R108.2 ; also sheet 3
BLINKER_RIGHT: Q22.3(D) X16.4 X17.4
GND: Q13.E Q14.3(S) Q16.E Q17.E Q18.E Q20.E Q21.2(S) Q22.2(S) Q23.E Q26.E R96.1 R98.1 R101.1 R106.1 R110.1 X19.2 ; also sheet 2,3,4,6,7
N$31: Q16.C Q26.B R114.1
N$32: Q27.3(D) X19.1
N$33: Q15.1(G) Q18.C R100.1 R101.2
N$34: Q17.C Q18.B R116.1
N$90: Q13.B R94.2
N$91: Q14.2(TAB)(D) X18.2
N$92: Q13.C Q14.1(G) R95.1 R96.2
N$93: Q26.C Q27.1(G) R97.1 R98.2
N$95: Q16.B R99.2
N$97: D24.1(A) D25.1(A) Q17.B R102.1
N$99: Q15.3(D) X19.3
N$100: Q20.B R104.1
N$101: Q20.C Q21.1(G) R105.1 R106.2
N$104: Q23.B R108.1
N$105: Q22.1(G) Q23.C R109.1 R110.2

### Notes on the sheet
- LED Driver
- Leon Reeh 5942
  IQ Technikum
  Semester: TEL HH_2023SS

## Sheet 6 of 7
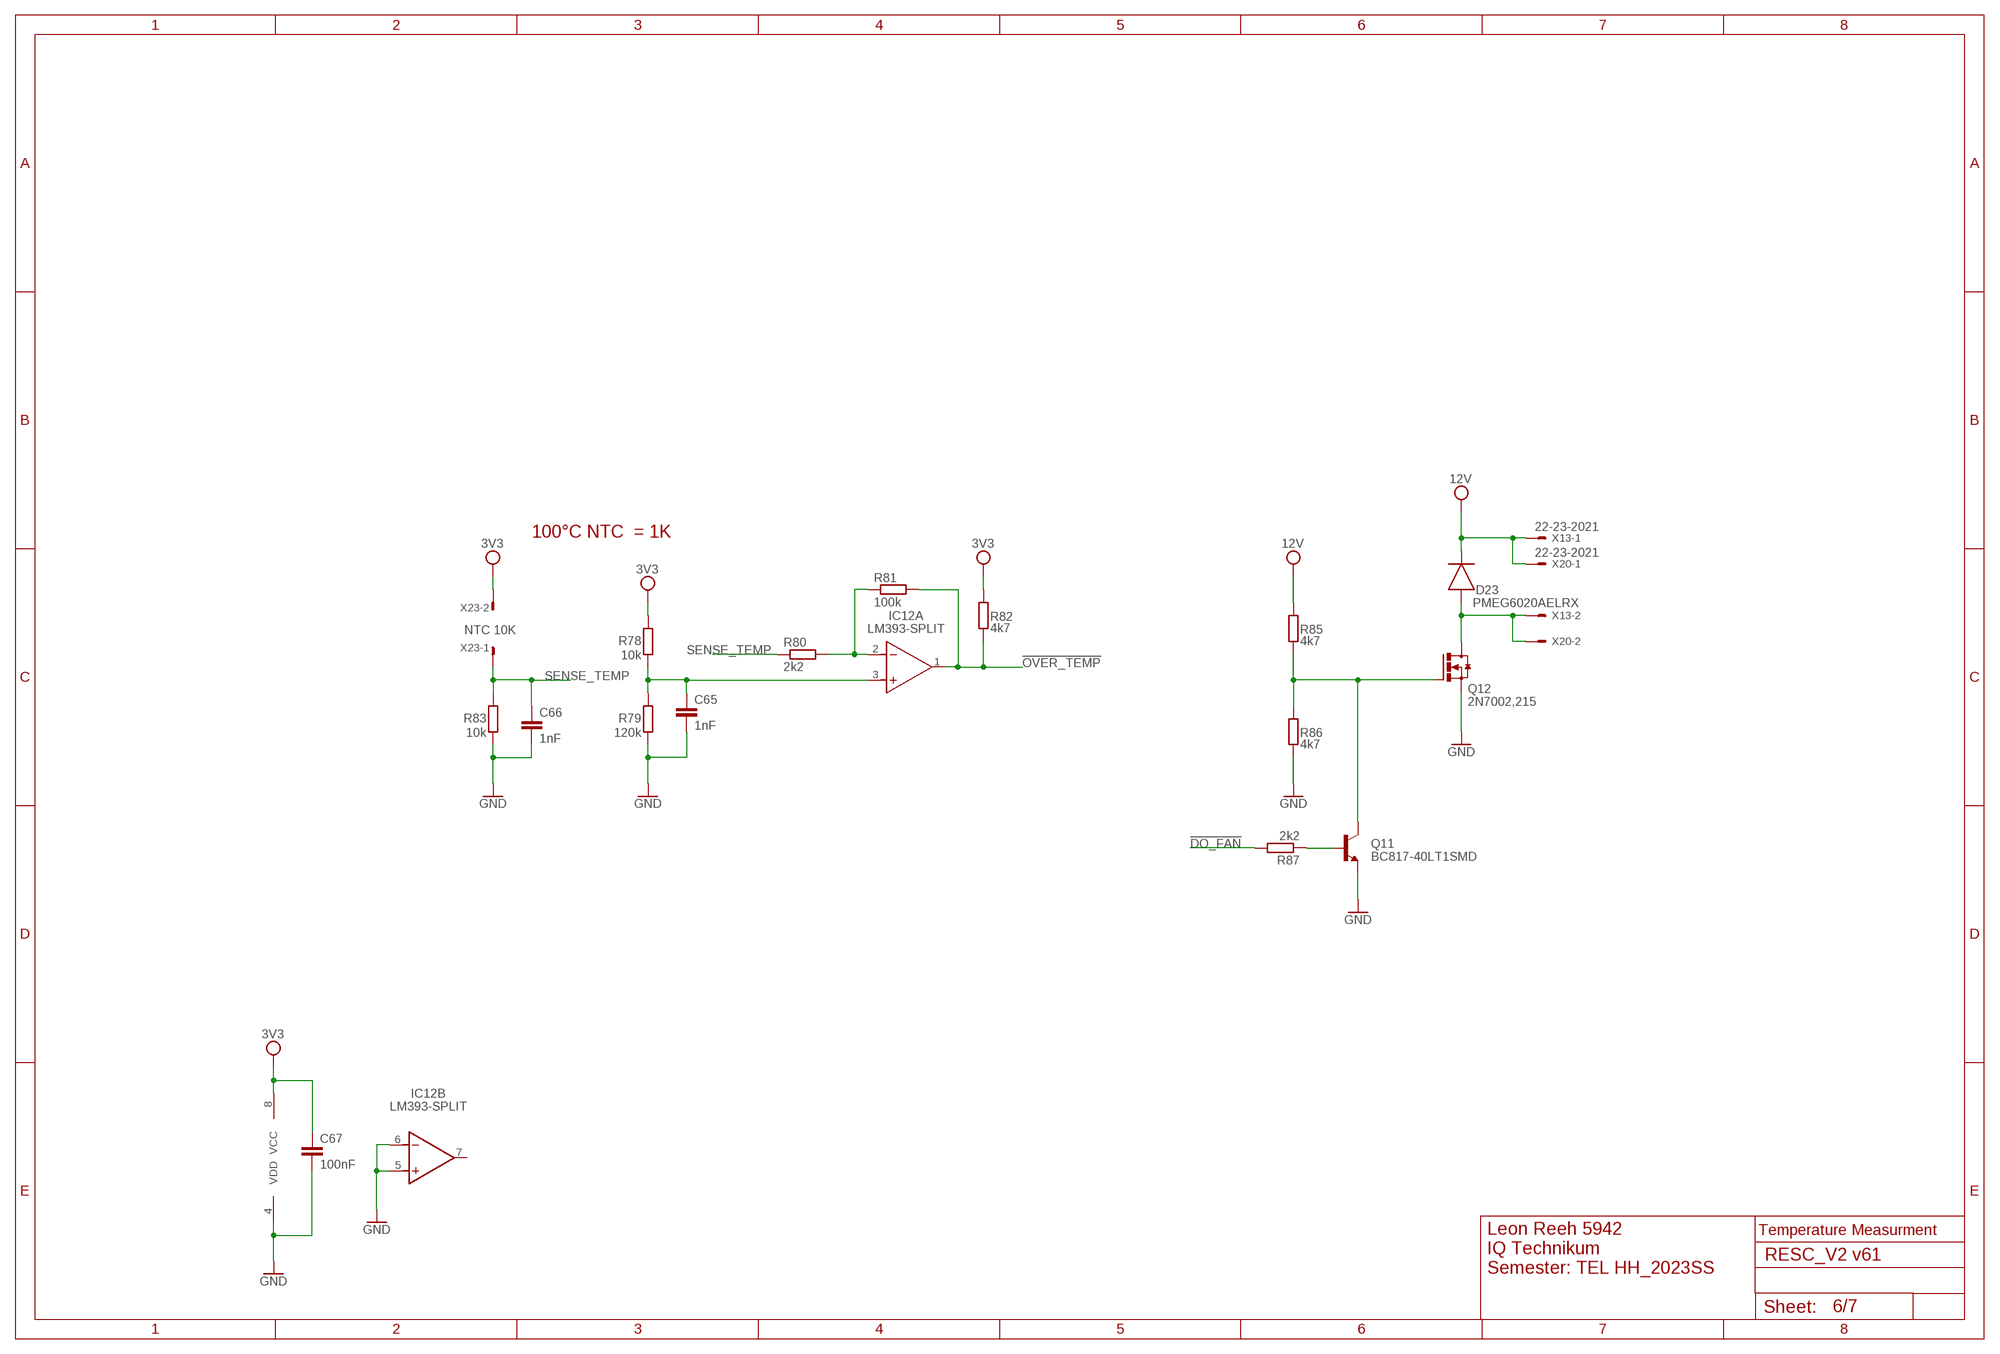
[diagram p5: schematic, sheet 6]

### Parts
C65  1nF  C-EUC0603  [C0603]
C66  1nF  C-EUC0603  [C0603]
C67  100nF  C-EUC0603  [C0603]
D23  PMEG6020AELRX  DIODE_MMSD4148T1G_SOD123G  [SOD3715X135]
IC12  LM393-SPLIT  [SOIC127P600X175-8]
Q11  BC817-40LT1SMD  [SOT23-BEC]
Q12  2N7002,215  [SOT23-3]
R78  10k  R-EU_R0603  [R0603]
R79  120k  R-EU_R0603  [R0603]
R80  2k2  R-EU_R0603  [R0603]
R81  100k  R-EU_R0603  [R0603]
R82  4k7  R-EU_R0603  [R0603]
R83  10k  R-EU_R0603  [R0603]
R85  4k7  R-EU_R0603  [R0603]
R86  4k7  R-EU_R0603  [R0603]
R87  2k2  R-EU_R0603  [R0603]
X13  22-23-2021  [22-23-2021]
X20  22-23-2021  [22-23-2021]
X23  NTC 10K  22-23-2021  [22-23-2021]

### Nets
3V3: C67.1 IC12.8(SUPPLY:VCC) R78.2 R82.2 X23.2 ; also sheet 2,3,4,5,7
12V: D23.1(C) R85.2 X13.1 X20.1 ; also sheet 2,4,5,7
!DO_FAN: R87.2 ; also sheet 3
!OVER_TEMP: IC12.1(A:OUT) R81.2 R82.1 ; also sheet 3
GND: C65.2 C66.2 C67.2 IC12.4(SUPPLY:VDD) IC12.5(B:+IN) IC12.6(B:-IN) Q11.E Q12.2(S) R79.1 R83.1 R86.1 ; also sheet 2,3,4,5,7
N$78: C65.1 IC12.3(A:+IN) R78.1 R79.2
N$79: IC12.2(A:-IN) R80.2 R81.1
N$80: Q11.C Q12.1(G) R85.1 R86.2
N$81: Q11.B R87.1
N$84: D23.2(A) Q12.3(D) X13.2 X20.2
SENSE_TEMP: C66.1 R80.1 R83.2 X23.1 ; also sheet 3
Unconnected: IC12.7(B:OUT)

### Notes on the sheet
- 100°C NTC  = 1K
- Temperature Measurment
- Leon Reeh 5942
  IQ Technikum
  Semester: TEL HH_2023SS

## Sheet 7 of 7
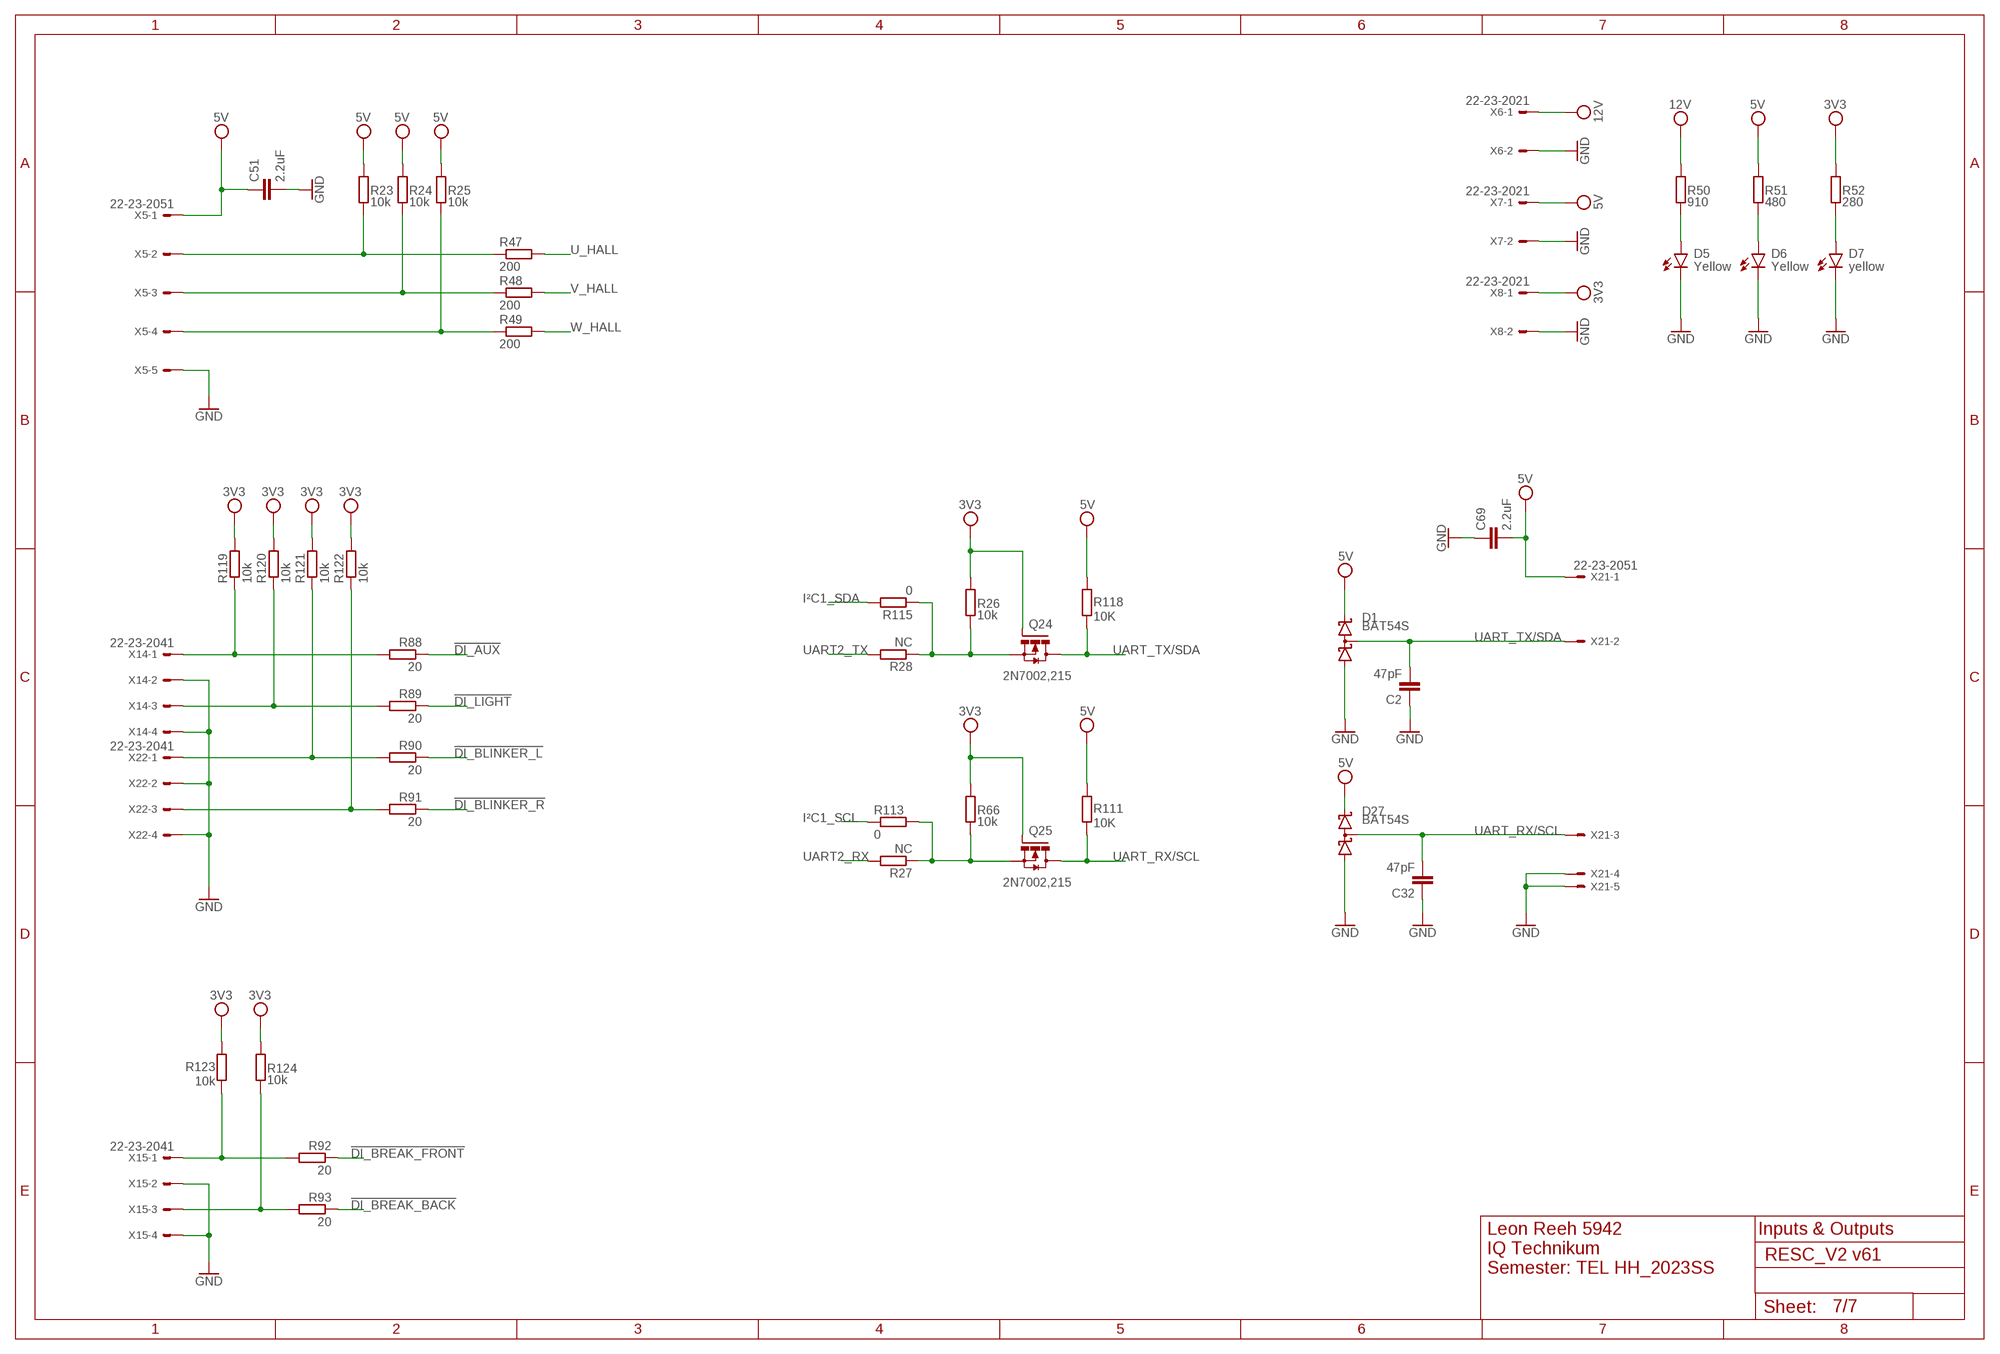
[diagram p6: schematic, sheet 7]

### Parts
C2  47pF  C-EUC0603  [C0603]
C32  47pF  C-EUC0603  [C0603]
C51  2.2uF  C-EUC0603  [C0603]
C69  2.2uF  C-EUC0603  [C0603]
D1  BAT54S  [SOT23]
D5  Yellow  CHIP-FLAT-B_1206  [LEDC3216X75N_FLAT-B]
D6  Yellow  CHIP-FLAT-B_1206  [LEDC3216X75N_FLAT-B]
D7  yellow  CHIP-FLAT-B_1206  [LEDC3216X75N_FLAT-B]
D27  BAT54S  [SOT23]
Q24  2N7002,215  [SOT23-3]
Q25  2N7002,215  [SOT23-3]
R23  10k  R-EU_R0603  [R0603]
R24  10k  R-EU_R0603  [R0603]
R25  10k  R-EU_R0603  [R0603]
R26  10k  R-EU_R0603  [R0603]
R27  NC  R-EU_R0603  [R0603]
R28  NC  R-EU_R0603  [R0603]
R47  200  R-EU_R0603  [R0603]
R48  200  R-EU_R0603  [R0603]
R49  200  R-EU_R0603  [R0603]
R50  910  R-EU_R1206  [R1206]
R51  480  R-EU_R1206  [R1206]
R52  280  R-EU_R1206  [R1206]
R66  10k  R-EU_R0603  [R0603]
R88  20  R-EU_R0603  [R0603]
R89  20  R-EU_R0603  [R0603]
R90  20  R-EU_R0603  [R0603]
R91  20  R-EU_R0603  [R0603]
R92  20  R-EU_R0603  [R0603]
R93  20  R-EU_R0603  [R0603]
R111  10K  R-EU_R0603  [R0603]
R113  0  R-EU_R0603  [R0603]
R115  0  R-EU_R0603  [R0603]
R118  10K  R-EU_R0603  [R0603]
R119  10k  R-EU_R0603  [R0603]
R120  10k  R-EU_R0603  [R0603]
R121  10k  R-EU_R0603  [R0603]
R122  10k  R-EU_R0603  [R0603]
R123  10k  R-EU_R0603  [R0603]
R124  10k  R-EU_R0603  [R0603]
X5  22-23-2051  [22-23-2051]
X6  22-23-2021  [22-23-2021]
X7  22-23-2021  [22-23-2021]
X8  22-23-2021  [22-23-2021]
X14  22-23-2041  [22-23-2041]
X15  22-23-2041  [22-23-2041]
X21  22-23-2051  [22-23-2051]
X22  22-23-2041  [22-23-2041]

### Nets
3V3: Q24.1(G) Q25.1(G) R26.2 R52.2 R66.2 R119.2 R120.2 R121.2 R122.2 R123.2 R124.2 X8.1 ; also sheet 2,3,4,5,6
5V: C51.1 C69.2 D1.2(C2) D27.2(C2) R23.2 R24.2 R25.2 R51.2 R111.2 R118.2 X5.1 X7.1 X21.1 ; also sheet 2,3
12V: R50.2 X6.1 ; also sheet 2,4,5,6
!DI_AUX: R88.1 ; also sheet 3
!DI_BLINKER_L: R90.1 ; also sheet 3
!DI_BLINKER_R: R91.1 ; also sheet 3
!DI_BREAK_BACK: R93.1 ; also sheet 3,5
!DI_BREAK_FRONT: R92.1 ; also sheet 5
!DI_LIGHT: R89.1 ; also sheet 3
GND: C2.1 C32.1 C51.2 C69.1 D1.1(A1) D5.C D6.C D7.C D27.1(A1) X5.5 X6.2 X7.2 X8.2 X14.2 X14.4 X15.2 X15.4 X21.4 X21.5 X22.2 X22.4 ; also sheet 2,3,4,5,6
I²C1_SCL: R113.1 ; also sheet 3
I²C1_SDA: R115.2 ; also sheet 3
N$21: R23.1 R47.1 X5.2
N$27: R24.1 R48.1 X5.3
N$28: R25.1 R49.1 X5.4
N$51: D5.A R50.1
N$53: D7.A R52.1
N$54: D6.A R51.1
N$83: R91.2 R122.1 X22.3
N$85: R93.2 R124.1 X15.3
N$86: R90.2 R121.1 X22.1
N$87: R92.2 R123.1 X15.1
N$88: R89.2 R120.1 X14.3
N$89: R88.2 R119.1 X14.1
U_HALL: R47.2 ; also sheet 3
UART2_RX: R27.2 ; also sheet 3
UART2_TX: R28.2 ; also sheet 3
UART2_TX1: Q24.2(S) R26.1 R28.1 R115.1
UART2_TX2: Q25.2(S) R27.1 R66.1 R113.2
UART_RX/SCL: C32.2 D27.3(C1A2) Q25.3(D) R111.1 X21.3
UART_TX/SDA: C2.2 D1.3(C1A2) Q24.3(D) R118.1 X21.2
V_HALL: R48.2 ; also sheet 3
W_HALL: R49.2 ; also sheet 3

### Notes on the sheet
- Inputs & Outputs
- Leon Reeh 5942
  IQ Technikum
  Semester: TEL HH_2023SS

## Library data of the parts
C1 C6 C15 C23 C46 C48 C50 = rcl:CPOL-EU: POLARIZED CAPACITOR, European symbol; SPICEPREFIX: C
C2-C5 C7-C13 C16-C22 C24-C32 C34-C45 C47 C49 C51-C67 C69 = rcl:C-EU: CAPACITOR, European symbol; SPICEPREFIX: C
C14 = rcl:CPOL-EU: POLARIZED CAPACITOR, European symbol
D1 D27 = diode:BAT54S: Schottky Diodes Pin connection corrected 2011-05-04 Source: Fairchild .. BAT54.pdf
D2 D3 = Diode:ZENER_: Zener Diode - Popular parts; CATEGORY: Diode; DESCRIPTION: DIODE ZENER 5.1V 500MW SOD80; MANUFACTURER: Vishay Semiconductor Diodes Division; MPN: TZM5231B-GS08; SUB-CATEGORY: Zener; THERMALLOSS: 0.5W; VALUE: TZM5231
D4 D11-D13 D23 = Diode:DIODE_: Diode Rectifier - Popular parts; CATEGORY: Diode; DESCRIPTION: MMSD4148T1G; MANUFACTURER: ON Semiconductor; SUB-CATEGORY: Rectifier; VALUE: MMSD4148T1G
D5-D7 D9 D10 = LED:CHIP-FLAT-B; CATEGORY: LED; COLOR: BLUE; DESCRIPTION: CHIP LED FLAT; SUB-CATEGORY: CHIP; TYPE: FLAT_TOP; VALUE: LED_BLUE
D14-D19 = Diode:DIODE: Diode Rectifier - Generic; CATEGORY: Diode; SUB-CATEGORY: Rectifier
D20-D22 D24 D25 = diode:BAS40: Silicon Schottky Diodes General-purpose diode for high-speed switching
F1 F2 = fuse:3557-2
HS1 = Bibliothek:VPR138/94-M3
IC1 IC9-IC11 = AD8418:AD8418
IC2 IC3 = Bibliothek:LMR36520
IC4 = Bibliothek:AZ1117IH-3.3TRG1
IC5 IC12 = IC_Linear:LM393-SPLIT
IC6-IC8 = Bibliothek:IR2101S: HIGH AND LOW SIDE DRIVER Features • Floating channel designed for bootstrap operation Fully operational to +600V, Tolerant to negative transient voltage, dV/dt immune • Gate drive supply range from 10 to 20V • Undervoltage lockout • 3.3V, 5V, and 15V logic input compatible • Matched propagation delay for both channels • Outputs in phase with inputs (IR2101) or out of phase with inputs (IR2102) Product Summary VOFFSET 600V max. IO+/- 130 mA / 270 mA VOUT 10 - 20V ton/off (typ.) 160 & 150 ns Delay Matching 50 ns Description The IR2101(S)/IR2102(S) are high voltage, high speed power MOSFET and IGBT drivers with independent high and low side referenced output channels. Proprietary HVIC and latch immune CMOS technologies enable ruggedized monolithic construction. The logic input is compatible with standard CMOS or LSTTL output, down to 3.3V logic. The output drivers feature a high pulse current buffer stage designed for minimum driver cross-conduction. The floating channel can be used to drive an N-channel power MOSFET or IGBT in the high side configuration which operates up to 600 volts. Packages 8-Lead SOIC IR2101S/IR2102S 8-Lead PDIP IR2101/IR2102
J1 = 2024-10-19_09-43-33_Library:BM08B-SRSS-TB(LF)(SN); COPYRIGHT: Copyright (C) 2024 Ultra Librarian. All rights reserved.; MANUFACTURER_PART_NUMBER: BM08B-SRSS-TB(LF)(SN); MFR_NAME: JST
K1 = Relays:JD2912-1Z-12VDC
L1 L2 = rcl:7847870
Q1-Q3 Q10 Q11 Q13 Q16-Q18 Q20 Q23 Q26 = transistor-npn:BC817*: NPN Transistor
Q4-Q9 = Transistor:IPB035N08N3GATMA1: MOSFET N-CH 80V 100A D2PAK Manufacturer's datasheet <https://www.infineon.com/dgdl/IPP037N08N3_Rev2.1.pdf?folderId=db3a304313b8b5a60113cee8763b02d7&fileId=db3a30431add1d95011ae8426111565b>; CREATED_BY: PCBLayout.com; DIGIKEY_PART_NUMBER: IPB035N08N3GATMA1CT-ND; MANUFACTURER: Infineon Technologies; MPN: IPB035N08N3GATMA1; PACKAGE: PG-TO263-3
Q12 Q19 Q21 Q22 Q24 Q25 = Transistor:2N7002,215: MOSFET N-CH 60V 300MA SOT-23 Manufacturer's datasheet <https://assets.nexperia.com/documents/data-sheet/2N7002.pdf>; CREATED_BY: PCBLayout.com; DIGIKEY_PART_NUMBER: 1727-2764-1-ND; MANUFACTURER: Nexperia USA Inc.; MPN: 2N7002,215; PACKAGE: SOT-23-3
Q14 = Bibliothek:IPD034N06N3
Q15 Q27 = Transistor:PMOSFET: P-Channel MOSFET - Generic; CATEGORY: Transistor; SUB-CATEGORY: MOSFET; TYPE: P-Channel
R1 R56 R60 R64 = resistor-shunt:WSLP2726
R2-R55 R57-R59 R61-R63 R65-R83 R85-R116 R118-R124 = rcl:R-EU_: RESISTOR, European symbol; SPICEPREFIX: R
U1 = Bibliothek:STM32F405RGT6; COPYRIGHT: Copyright (C) 2024 Ultra Librarian. All rights reserved.; MANUFACTURER_PART_NUMBER: STM32F405RGT6; MFR_NAME: STMicroelectronics
X1 X2 X9-X11 = con-molex:63849-1
X3 X4 X6-X8 X13 X18 X20 X23 = con-molex:22-23-2021: .100" (2.54mm) Center Header - 2 Pin; MF: MOLEX; MPN: 22-23-2021; OC_FARNELL: 1462926; OC_NEWARK: 25C3832
X5 X21 = con-molex:22-23-2051: .100" (2.54mm) Center Header - 5 Pin; MF: MOLEX; MPN: 22-23-2051; OC_FARNELL: 1462952; OC_NEWARK: 38C9178
X12 X19 = con-molex:22-23-2031: .100" (2.54mm) Center Header - 3 Pin; MF: MOLEX; MPN: 22-23-2031; OC_FARNELL: 1462950; OC_NEWARK: 30C0862
X14-X17 X22 = con-molex:22-23-2041: .100" (2.54mm) Center Header - 4 Pin; MF: MOLEX; MPN: 22-23-2041; OC_FARNELL: 1462920; OC_NEWARK: 38C0355
XTAL1 = Bibliothek:7B: CRYSTAL 8MHZ to 40MHZ 18PF SMD Datasheet <http://www.txccorp.com/download/products/quartz_crystals/2015TXC_7B_19.pdf>; CATEGORY: Crystals; MANUFACTURER: TXC CORPORATION; MPN: 7B-8.000MAAJ-T; OPERATING_TEMPERATURE: -20°C ~ 70°C; PART_STATUS: ACTIVE; ROHS_COMPLIANT: COMPLIANT; SERIES: 7B; SUB_CATEGORY: Crystal SMD; TYPE: Surface mount 4-pin; VALUE: 8MHZ